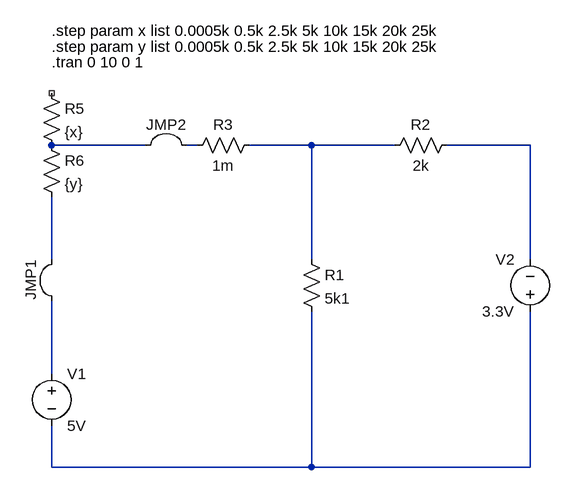
[diagram p0: schematic Draft2.asc]
Draft2.asc, the LTspice schematic file:
Version 4.1
SHEET 1 880 680
WIRE 144 128 0 128
WIRE 224 128 208 128
WIRE 400 128 304 128
WIRE 528 128 400 128
WIRE 736 128 608 128
WIRE 0 304 0 208
WIRE 400 304 400 128
WIRE 736 304 736 128
WIRE 0 480 0 368
WIRE 0 624 0 560
WIRE 400 624 400 384
WIRE 400 624 0 624
WIRE 736 624 736 384
WIRE 736 624 400 624
SYMBOL res -16 32 R0
SYMATTR InstName R5
SYMATTR Value {x}
SYMBOL res -16 112 R0
SYMATTR InstName R6
SYMATTR Value {y}
SYMBOL res 384 288 R0
SYMATTR InstName R1
SYMATTR Value 5k1
SYMBOL res 624 112 R90
WINDOW 0 0 56 VBottom 2
WINDOW 3 32 56 VTop 2
SYMATTR InstName R2
SYMATTR Value 2k
SYMBOL Misc\\jumper -64 336 R270
SYMATTR InstName JMP1
SYMBOL Misc\\jumper 176 64 R0
SYMATTR InstName JMP2
SYMBOL res 320 112 R90
WINDOW 0 0 56 VBottom 2
WINDOW 3 32 56 VTop 2
SYMATTR InstName R3
SYMATTR Value 1m
SYMBOL voltage 0 464 R0
SYMATTR InstName V1
SYMATTR Value 5V
SYMBOL voltage 736 400 R180
WINDOW 0 24 96 Left 2
WINDOW 3 24 16 Left 2
SYMATTR InstName V2
SYMATTR Value 3.3V
TEXT 0 -48 Left 2 !.step param x list 0.0005k 0.5k 2.5k 5k 10k 15k 20k 25k
TEXT 0 -24 Left 2 !.step param y list 0.0005k 0.5k 2.5k 5k 10k 15k 20k 25k
TEXT 0 0 Left 2 !.tran 0 10 0 1

The netlist it stands for:
* Draft2.asc
R5 NC_01 N001 {x}
R6 N001 N004 {y}
R1 N002 N005 5k1
R2 N003 N002 2k
R3 N002 N001 1m
V1 N004 N005 5V
V2 N005 N003 3.3V
.step param x list 0.0005k 0.5k 2.5k 5k 10k 15k 20k 25k
.step param y list 0.0005k 0.5k 2.5k 5k 10k 15k 20k 25k
.tran 0 10 0 1
.backanno
.end